# EAGLE schematic main_schematic_8 (EAGLE 8.7.0)
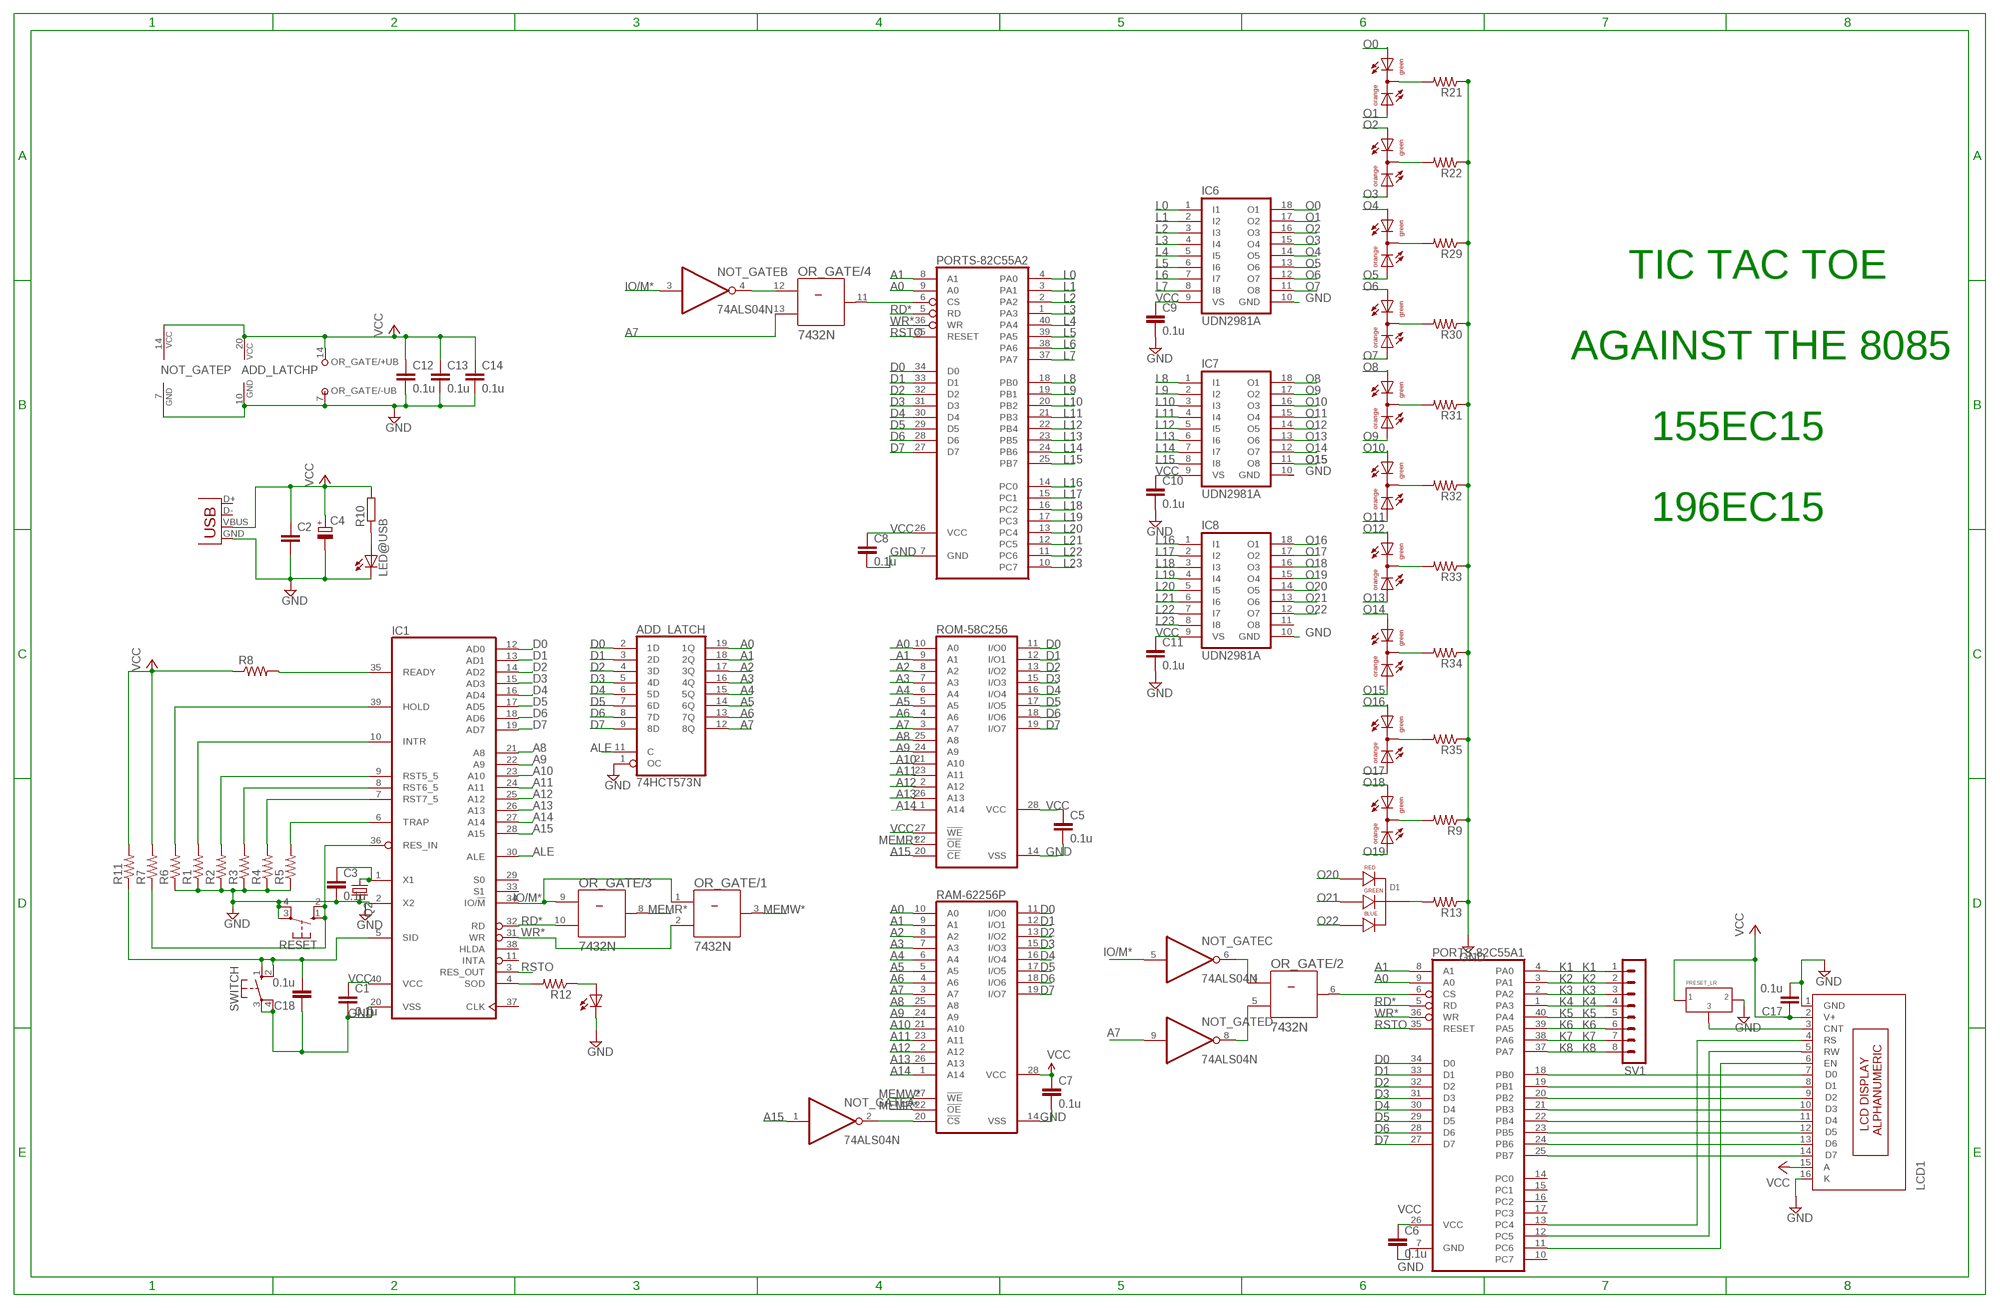
[diagram p0: schematic, sheet 1]

## Parts
ADD_LATCH  74HCT573N  [DIL20]
C1  0.1u  C2,5-3  [C2.5-3]
C2  C-EU025-024X044  [C025-024X044]
C3  0.1u  C-EU025-024X044  [C025-024X044]
C4  CPOL-EUE5-8.5  [E5-8,5]
C5  0.1u  C-EU025-024X044  [C025-024X044]
C6  0.1u  C-EU050-024X044  [C050-024X044]
C7  0.1u  C-EU025-024X044  [C025-024X044]
C8  0.1u  C-EU025-024X044  [C025-024X044]
C9  0.1u  C-EU025-024X044  [C025-024X044]
C10  0.1u  C-EU025-024X044  [C025-024X044]
C11  0.1u  C-EU025-024X044  [C025-024X044]
C12  0.1u  C-EU025-024X044  [C025-024X044]
C13  0.1u  C-EU025-024X044  [C025-024X044]
C14  0.1u  C-EU025-024X044  [C025-024X044]
C17  0.1u  C-EU025-024X044  [C025-024X044]
C18  0.1u  C2,5-3  [C2.5-3]
D1  LED-RGB-CC-THRUCLEAR  [LED-RGB-THRU]
IC1  8085  [DIL40]
IC6  UDN2981A  [DIL18]
IC7  UDN2981A  [DIL18]
IC8  UDN2981A  [DIL18]
LCD1  16X2LCD  [16X2_LCD]
LED@SOD  LED3MM  [LED3MM]
LED@USB  LED5MM  [LED5MM]
LEDA  TLUV5300  [TLUV5300]
LEDB  TLUV5300  [TLUV5300]
LEDC  TLUV5300  [TLUV5300]
LEDD  TLUV5300  [TLUV5300]
LEDE  TLUV5300  [TLUV5300]
LEDF  TLUV5300  [TLUV5300]
LEDG  TLUV5300  [TLUV5300]
LEDH  TLUV5300  [TLUV5300]
LEDI  TLUV5300  [TLUV5300]
LEDJ  TLUV5300  [TLUV5300]
NOT_GATE  74ALS04N  [DIL14]
OR_GATE  7432N  [DIL14]
PORTS-82C55A1  82C55A  [DIL40]
PORTS-82C55A2  82C55A  [DIL40]
Q2  CRYSTALHC49US  [HC49US]
R1  R-US_0204/2V  [0204V]
R2  R-US_0204/2V  [0204V]
R3  R-US_0204/2V  [0204V]
R4  R-US_0204/2V  [0204V]
R5  R-US_0204/2V  [0204V]
R6  R-US_0204/2V  [0204V]
R7  R-US_0204/2V  [0204V]
R8  R-US_0204/2V  [0204V]
R9  R-US_0204/2V  [0204V]
R10  R-EU_0204/7  [0204/7]
R11  R-US_0204/2V  [0204V]
R12  R-US_0204/2V  [0204V]
R13  R-US_0204/2V  [0204V]
R21  R-US_0204/2V  [0204V]
R22  R-US_0204/2V  [0204V]
R29  R-US_0204/2V  [0204V]
R30  R-US_0204/2V  [0204V]
R31  R-US_0204/2V  [0204V]
R32  R-US_0204/2V  [0204V]
R33  R-US_0204/2V  [0204V]
R34  R-US_0204/2V  [0204V]
R35  R-US_0204/2V  [0204V]
RAM-62256P  62256P  [DIL28-6]
RESET  10-XX  [B3F-10XX]
ROM-58C256  58C256P  [DIL28-6]
SV1  MA08-1  [MA08-1]
SWITCH  10-XX  [B3F-10XX]
U$2  PRESET_LR  [PRESET_LR]
X1  USBSMD  [USB-MINIB]

## Nets
A0: ADD_LATCH.19(1Q) PORTS-82C55A1.9(A0) PORTS-82C55A2.9(A0) RAM-62256P.10(A0) ROM-58C256.10(A0)
A1: ADD_LATCH.18(2Q) PORTS-82C55A1.8(A1) PORTS-82C55A2.8(A1) RAM-62256P.9(A1) ROM-58C256.9(A1)
A2: ADD_LATCH.17(3Q) RAM-62256P.8(A2) ROM-58C256.8(A2)
A3: ADD_LATCH.16(4Q) RAM-62256P.7(A3) ROM-58C256.7(A3)
A4: ADD_LATCH.15(5Q) RAM-62256P.6(A4) ROM-58C256.6(A4)
A5: ADD_LATCH.14(6Q) RAM-62256P.5(A5) ROM-58C256.5(A5)
A6: ADD_LATCH.13(7Q) RAM-62256P.4(A6) ROM-58C256.4(A6)
A7: ADD_LATCH.12(8Q) NOT_GATE.9(D:I) OR_GATE.13(/4:B) RAM-62256P.3(A7) ROM-58C256.3(A7)
A8: IC1.21(A8) RAM-62256P.25(A8) ROM-58C256.25(A8)
A9: IC1.22(A9) RAM-62256P.24(A9) ROM-58C256.24(A9)
A10: IC1.23(A10) RAM-62256P.21(A10) ROM-58C256.21(A10)
A11: IC1.24(A11) RAM-62256P.23(A11) ROM-58C256.23(A11)
A12: IC1.25(A12) RAM-62256P.2(A12) ROM-58C256.2(A12)
A13: IC1.26(A13) RAM-62256P.26(A13) ROM-58C256.26(A13)
A14: IC1.27(A14) RAM-62256P.1(A14) ROM-58C256.1(A14)
A15: IC1.28(A15) NOT_GATE.1(A:I) ROM-58C256.20(!CE)
ALE: ADD_LATCH.11(C) IC1.30(ALE)
D0: ADD_LATCH.2(1D) IC1.12(AD0) PORTS-82C55A1.34(D0) PORTS-82C55A2.34(D0) RAM-62256P.11(I/O0) ROM-58C256.11(I/O0)
D1: ADD_LATCH.3(2D) IC1.13(AD1) PORTS-82C55A1.33(D1) PORTS-82C55A2.33(D1) RAM-62256P.12(I/O1) ROM-58C256.12(I/O1)
D2: ADD_LATCH.4(3D) IC1.14(AD2) PORTS-82C55A1.32(D2) PORTS-82C55A2.32(D2) RAM-62256P.13(I/O2) ROM-58C256.13(I/O2)
D3: ADD_LATCH.5(4D) IC1.15(AD3) PORTS-82C55A1.31(D3) PORTS-82C55A2.31(D3) RAM-62256P.15(I/O3) ROM-58C256.15(I/O3)
D4: ADD_LATCH.6(5D) IC1.16(AD4) PORTS-82C55A1.30(D4) PORTS-82C55A2.30(D4) RAM-62256P.16(I/O4) ROM-58C256.16(I/O4)
D5: ADD_LATCH.7(6D) IC1.17(AD5) PORTS-82C55A1.29(D5) PORTS-82C55A2.29(D5) RAM-62256P.17(I/O5) ROM-58C256.17(I/O5)
D6: ADD_LATCH.8(7D) IC1.18(AD6) PORTS-82C55A1.28(D6) PORTS-82C55A2.28(D6) RAM-62256P.18(I/O6) ROM-58C256.18(I/O6)
D7: ADD_LATCH.9(8D) IC1.19(AD7) PORTS-82C55A1.27(D7) PORTS-82C55A2.27(D7) RAM-62256P.19(I/O7) ROM-58C256.19(I/O7)
GND: ADD_LATCH.1(OC) ADD_LATCH.10(GND) C1.2 C2.2 C3.2 C4.- C5.2 C6.2 C7.2 C8.2 C9.2 C10.2 C11.2 C12.2 C13.2 C14.2 C17.2 C18.1 IC1.2(X2) IC1.20(VSS) IC6.10(GND) IC7.10(GND) IC8.10(GND) LCD1.1(GND) LCD1.16(K) LED@SOD.K(C) LED@USB.K(C) NOT_GATE.7(P:GND) OR_GATE.7(/-UB:-UB) PORTS-82C55A1.7(GND) PORTS-82C55A2.7(GND) Q2.2 R1.1 R2.1 R3.1 R4.1 R5.1 R6.1 R9.1 R13.1 R21.1 R22.1 R29.1 R30.1 R31.1 R32.1 R33.1 R34.1 R35.1 RAM-62256P.14(VSS) RESET.3(P) RESET.4(P1) ROM-58C256.14(VSS) SWITCH.3(P) SWITCH.4(P1) U$2.P$2 X1.GND
IO/M*: IC1.34(IO/!M) NOT_GATE.3(B:I) NOT_GATE.5(C:I) OR_GATE.1(/1:A) OR_GATE.9(/3:A)
K1: PORTS-82C55A1.4(PA0) SV1.1
K2: PORTS-82C55A1.3(PA1) SV1.2
K3: PORTS-82C55A1.2(PA2) SV1.3
K4: PORTS-82C55A1.1(PA3) SV1.4
K5: PORTS-82C55A1.40(PA4) SV1.5
K6: PORTS-82C55A1.39(PA5) SV1.6
K7: PORTS-82C55A1.38(PA6) SV1.7
K8: PORTS-82C55A1.37(PA7) SV1.8
L0: IC6.1(I1) PORTS-82C55A2.4(PA0)
L1: IC6.2(I2) PORTS-82C55A2.3(PA1)
L2: IC6.3(I3) PORTS-82C55A2.2(PA2)
L3: IC6.4(I4) PORTS-82C55A2.1(PA3)
L4: IC6.5(I5) PORTS-82C55A2.40(PA4)
L5: IC6.6(I6) PORTS-82C55A2.39(PA5)
L6: IC6.7(I7) PORTS-82C55A2.38(PA6)
L7: IC6.8(I8) PORTS-82C55A2.37(PA7)
L8: IC7.1(I1) PORTS-82C55A2.18(PB0)
L9: IC7.2(I2) PORTS-82C55A2.19(PB1)
L10: IC7.3(I3) PORTS-82C55A2.20(PB2)
L11: IC7.4(I4) PORTS-82C55A2.21(PB3)
L12: IC7.5(I5) PORTS-82C55A2.22(PB4)
L13: IC7.6(I6) PORTS-82C55A2.23(PB5)
L14: IC7.7(I7) PORTS-82C55A2.24(PB6)
L15: IC7.8(I8) PORTS-82C55A2.25(PB7)
L16: IC8.1(I1) PORTS-82C55A2.14(PC0)
L17: IC8.2(I2) PORTS-82C55A2.15(PC1)
L18: IC8.3(I3) PORTS-82C55A2.16(PC2)
L19: IC8.4(I4) PORTS-82C55A2.17(PC3)
L20: IC8.5(I5) PORTS-82C55A2.13(PC4)
L21: IC8.6(I6) PORTS-82C55A2.12(PC5)
L22: IC8.7(I7) PORTS-82C55A2.11(PC6)
L23: IC8.8(I8) PORTS-82C55A2.10(PC7)
MEMR*: OR_GATE.8(/3:Y) RAM-62256P.22(!OE) ROM-58C256.22(!OE)
MEMW*: OR_GATE.3(/1:Y) RAM-62256P.27(!WE)
N$1: IC1.39(HOLD) R6.2
N$2: IC1.10(INTR) R1.2
N$3: IC1.9(RST5_5) R2.2
N$4: IC1.8(RST6_5) R3.2
N$5: IC1.7(RST7_5) R4.2
N$6: IC1.6(TRAP) R5.2
N$7: IC1.36(RES_IN) R7.1 RESET.1(S) RESET.2(S1)
N$8: IC1.35(READY) R8.2
N$9: C18.2 IC1.5(SID) R11.1 SWITCH.1(S) SWITCH.2(S1)
N$10: C3.1 IC1.1(X1) Q2.1
N$11: NOT_GATE.2(A:O) RAM-62256P.20(!CS)
N$12: D1.2(CATHODE) R13.2
N$13: NOT_GATE.6(C:O) OR_GATE.4(/2:A)
N$14: IC1.4(SOD) R12.2
N$15: LED@SOD.A R12.1
N$16: OR_GATE.6(/2:Y) PORTS-82C55A1.6(CS)
N$17: OR_GATE.11(/4:Y) PORTS-82C55A2.6(CS)
N$18: LCD1.4(RS) PORTS-82C55A1.13(PC4)
N$19: LCD1.5(RW) PORTS-82C55A1.12(PC5)
N$20: LCD1.6(EN) PORTS-82C55A1.11(PC6)
N$24: LEDJ.CC R9.2
N$31: NOT_GATE.4(B:O) OR_GATE.12(/4:A)
N$38: NOT_GATE.8(D:O) OR_GATE.5(/2:B)
N$44: LED@USB.A R10.1
N$75: LCD1.14(D7) PORTS-82C55A1.25(PB7)
N$76: LCD1.13(D6) PORTS-82C55A1.24(PB6)
N$88: LCD1.12(D5) PORTS-82C55A1.23(PB5)
N$92: LCD1.11(D4) PORTS-82C55A1.22(PB4)
N$93: LCD1.10(D3) PORTS-82C55A1.21(PB3)
N$95: LCD1.9(D2) PORTS-82C55A1.20(PB2)
N$96: LCD1.8(D1) PORTS-82C55A1.19(PB1)
N$97: LCD1.7(D0) PORTS-82C55A1.18(PB0)
N$98: LCD1.3(CNT) U$2.P$3
N$155: LEDI.CC R35.2
N$156: LEDH.CC R34.2
N$157: LEDG.CC R33.2
N$158: LEDF.CC R32.2
N$159: LEDD.CC R30.2
N$160: LEDC.CC R29.2
N$161: LEDB.CC R22.2
N$162: LEDA.CC R21.2
N$163: LEDE.CC R31.2
O0: IC6.18(O1) LEDA.AG
O1: IC6.17(O2) LEDA.AO
O2: IC6.16(O3) LEDB.AG
O3: IC6.15(O4) LEDB.AO
O4: IC6.14(O5) LEDC.AG
O5: IC6.13(O6) LEDC.AO
O6: IC6.12(O7) LEDD.AG
O7: IC6.11(O8) LEDD.AO
O8: IC7.18(O1) LEDE.AG
O9: IC7.17(O2) LEDE.AO
O10: IC7.16(O3) LEDF.AG
O11: IC7.15(O4) LEDF.AO
O12: IC7.14(O5) LEDG.AG
O13: IC7.13(O6) LEDG.AO
O14: IC7.12(O7) LEDH.AG
O15: IC7.11(O8) LEDH.AO
O16: IC8.18(O1) LEDI.AG
O17: IC8.17(O2) LEDI.AO
O18: IC8.16(O3) LEDJ.AG
O19: IC8.15(O4) LEDJ.AO
O20: D1.1(RED_CATHODE) IC8.14(O5)
O21: D1.3(GREEN_CATHODE) IC8.13(O6)
O22: D1.4(BLUE_CATHODE) IC8.12(O7)
RD*: IC1.32(RD) OR_GATE.10(/3:B) PORTS-82C55A1.5(RD) PORTS-82C55A2.5(RD)
RSTO: IC1.3(RES_OUT) PORTS-82C55A1.35(RESET) PORTS-82C55A2.35(RESET)
VCC: ADD_LATCH.20(VCC) C1.1 C2.1 C4.+ C5.1 C6.1 C7.1 C8.1 C9.1 C10.1 C11.1 C12.1 C13.1 C14.1 C17.1 IC1.40(VCC) IC6.9(VS) IC7.9(VS) IC8.9(VS) LCD1.2(V+) LCD1.15(A) NOT_GATE.14(P:VCC) OR_GATE.14(/+UB:+UB) PORTS-82C55A1.26(VCC) PORTS-82C55A2.26(VCC) R7.2 R8.1 R10.2 R11.2 RAM-62256P.28(VCC) ROM-58C256.27(!WE) ROM-58C256.28(VCC) U$2.P$1 X1.VBUS
WR*: IC1.31(WR) OR_GATE.2(/1:B) PORTS-82C55A1.36(WR) PORTS-82C55A2.36(WR)
Unconnected: IC1.11(INTA) IC1.29(S0) IC1.33(S1) IC1.37(CLK) IC1.38(HLDA) IC8.11(O8) NOT_GATE.10(E:O) NOT_GATE.11(E:I) NOT_GATE.12(F:O) NOT_GATE.13(F:I) PORTS-82C55A1.10(PC7) PORTS-82C55A1.14(PC0) PORTS-82C55A1.15(PC1) PORTS-82C55A1.16(PC2) PORTS-82C55A1.17(PC3) X1.D+ X1.D-

## Notes on the sheet
- TIC TAC TOE
- AGAINST THE 8085
- 155EC15
- 196EC15

## Library data of the parts
ADD_LATCH = 74xx-eu:74*573: 8-bit D latch BUS DRIVER
C1 C18 = capacitor-wima:C: CAPACITOR naming: grid - package width
C2 C3 C5 C7-C14 C17 = rcl:C-EU: CAPACITOR, European symbol
C4 = rcl:CPOL-EU: POLARIZED CAPACITOR, European symbol
C6 = resistor:C-EU: CAPACITOR, European symbol
D1 = SparkFun-LED:LED-RGB-CC-THRU: RGB Through-hole common cathode LED SparkFun Storefront: COM-00105 (Clear) COM-09264 (Diffuse); PROD_ID: DIO-08418
IC1 = micro-intel:8085: MICROCOMPUTER/PERIPHERAL DEVICE; OC_FARNELL: unknown; OC_NEWARK: unknown
IC6-IC8 = uln-udn:UDN298*: DRIVER ARRAY Source: Allegro Microsystems Inc. / UDN2981-UDN2984.pdf
LCD1 = CEDT_JANUARY_2015_v5:16X2LCD: ALPHANUMERIC-LCD
LED@SOD = led:LED: LED OSRAM: - CHIPLED LG R971, LG N971, LY N971, LG Q971, LY Q971, LO R971, LY R971 LH N974, LH R974 LS Q976, LO Q976, LY Q976 LO Q996 - Hyper CHIPLED LW Q18S LB Q993, LB Q99A, LB R99A - SideLED LS A670, LO A670, LY A670, LG A670, LP A670 LB A673, LV A673, LT A673, LW A673 LH A674 LY A675 LS A676, LA A676, LO A676, LY A676, LW A676 LS A679, LY A679, LG A679 - Hyper Micro SIDELED® LS Y876, LA Y876, LO Y876, LY Y876 LT Y87S - SmartLED LW L88C, LW L88S LB L89C, LB L89S, LG L890 LS L89K, LO L89K, LY L89K LS L896, LA L896, LO L896, LY L896 - TOPLED LS T670, LO T670, LY T670, LG T670, LP T670 LSG T670, LSP T670, LSY T670, LOP T670, LYG T670 LG T671, LOG T671, LSG T671 LB T673, LV T673, LT T673, LW T673 LH T674 LS T676, LA T676, LO T676, LY T676, LB T676, LH T676, LSB T676, LW T676 LB T67C, LV T67C, LT T67C, LS T67K, LO T67K, LY T67K, LW E67C LS E67B, LA E67B, LO E67B, LY E67B, LB E67C, LV E67C, LT E67C LW T67C LS T679, LY T679, LG T679 LS T770, LO T770, LY T770, LG T770, LP T770 LB T773, LV T773, LT T773, LW T773 LH T774 LS E675, LA E675, LY E675, LS T675 LS T776, LA T776, LO T776, LY T776, LB T776 LHGB T686 LT T68C, LB T68C - Hyper Mini TOPLED® LB M676 - Mini TOPLED Santana® LG M470 LS M47K, LO M47K, LY M47K Source: http://www.osram.convergy.de LUXEON: - LUMILED® LXK2-PW12-R00, LXK2-PW12-S00, LXK2-PW14-U00, LXK2-PW14-V00 LXK2-PM12-R00, LXK2-PM12-S00, LXK2-PM14-U00 LXK2-PE12-Q00, LXK2-PE12-R00, LXK2-PE12-S00, LXK2-PE14-T00, LXK2-PE14-U00 LXK2-PB12-K00, LXK2-PB12-L00, LXK2-PB12-M00, LXK2-PB14-N00, LXK2-PB14-P00, LXK2-PB14-Q00 LXK2-PR12-L00, LXK2-PR12-M00, LXK2-PR14-Q00, LXK2-PR14-R00 LXK2-PD12-Q00, LXK2-PD12-R00, LXK2-PD12-S00 LXK2-PH12-R00, LXK2-PH12-S00 LXK2-PL12-P00, LXK2-PL12-Q00, LXK2-PL12-R00 Source: www.luxeon.com KINGBRIGHT: KA-3528ASYC Source: www.kingbright.com
LED@USB = CEDTv79:LED
LEDA LEDB LEDC LEDD LEDE LEDF LEDG LEDH LEDI LEDJ = led:TLUV5300: Bicolor LED 5 mm Untinted Diffused Package Source: www.vishay.com .. Bi-Color LED Vashay TLUV5300.pdf
NOT_GATE = 74xx-us:74*04: Hex INVERTER
OR_GATE = 74ttl-din:74*32: Quad 2-input OR gate; SPICEPREFIX: J
PORTS-82C55A1 PORTS-82C55A2 = micro-intel:82C55A: MICROCOMPUTER/PERIPHERAL DEVICE; MF: INTERSIL; MPN: IP82C55AZ; OC_FARNELL: 1562050; OC_NEWARK: 79K6939
Q2 = CEDT:CRYSTAL: Crystals Various standard crystals. Proven footprints. Spark Fun Electronics SKU : COM-00534
R1-R9 R11-R13 R21 R22 R29-R35 = rcl:R-US_: RESISTOR, American symbol; SPICEPREFIX: R
R10 = resistor:R-EU_: RESISTOR, European symbol
RAM-62256P = memory-hitachi:62256P: MEMORY; OC_FARNELL: unknown; OC_NEWARK: unknown
RESET = CEDT:10-XX: OMRON SWITCH
ROM-58C256 = memory-hitachi:58C256P: MEMORY; MPN: HN58C256AP85E; OC_FARNELL: 1496447; OC_NEWARK: 61M6616
SV1 = con-lstb:MA08-1: PIN HEADER; OC_FARNELL: unknown; OC_NEWARK: unknown
SWITCH = CEDTv69:10-XX: OMRON SWITCH
U$2 = CEDT_JANUARY_2015_v5:PRESET_LR
X1 = CEDTv79:USB: USB Connectors USB-B-PTH is fully proven SKU : PRT-00139 USB-miniB is fully proven SKU : PRT-00587 USB-A-PCB is untested. USB-A-H is throughly reviewed, but untested. Spark Fun Electronics SKU : PRT-00437 USB-B-SMT is throughly reviewed, but untested. Needs silkscreen touching up. USB-A-S has not been used/tested USB-MB-H has not been used/tested

## Net classes
0 default: width 0.406 mm
1 power: width 0.61 mm
2 GND: width 0.61 mm